# Altium project mb1191.PrjPCB (part 3 of 3)
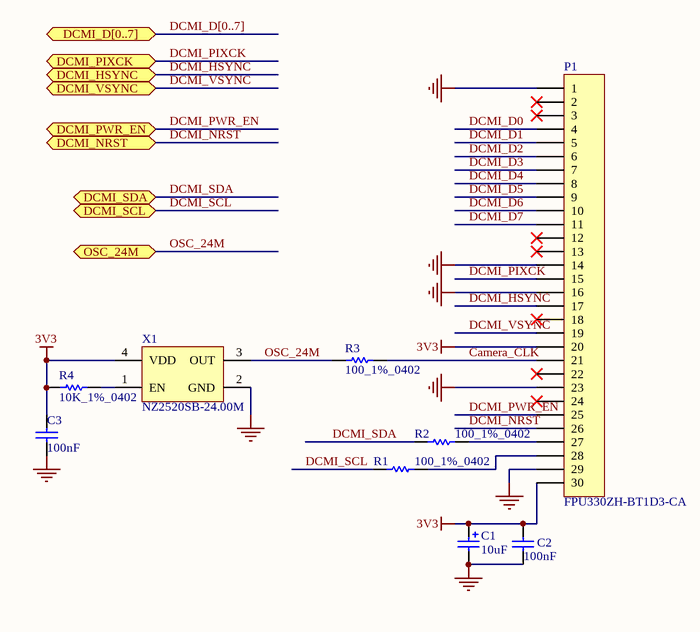
[diagram p13: Camera-Connectors.SchDoc]

## Nets that join several sheets
1V8: ST_LINK_V2-1 (C108.2 U13.2 U13.4), AUDIO (6 pins), USB_OTG_HS (C110.2 U15.28 U15.30)
3V3: ST_LINK_V2-1 (C68.2 C75.2 U7.4 U13.3), AUDIO (14 pins), USB_OTG_FS (R116.2 R126.2 R136.2 R137.2), Peripherals (9 pins), QSPI (C38.2 R57.2 U3.8), LCD-43 (5 pins), Arduino_ Connectors (CN6.2 CN6.4), SDRAM (28 pins), USB_OTG_HS (8 pins), STM32F7 (11 pins), Ethernet (17 pins), Camera-Connectors (7 pins)
5V: ST_LINK_V2-1 (10 pins), USB_OTG_FS (U16.5), Peripherals (SB2.2), Arduino_ Connectors (CN6.5), USB_OTG_HS (C117.1 U15.21 U17.5)
5V_USB_FS: ST_LINK_V2-1 (D3.1 JP1.5), USB_OTG_FS (SB18.1)
5V_USB_HS: ST_LINK_V2-1 (D4.1 JP1.7), USB_OTG_HS (CN12.1 D7.A1 L6.2)
GND: ST_LINK_V2-1 (46 pins), AUDIO (43 pins), USB_OTG_FS (7 pins), Peripherals (8 pins), QSPI (C38.1 U3.4), LCD-43 (8 pins), Arduino_ Connectors (5 pins), SDRAM (46 pins), USB_OTG_HS (23 pins), STM32F7 (54 pins), Ethernet (19 pins), Camera-Connectors (9 pins)
VDD: Peripherals (B1.1 B1.4), STM32F7 (43 pins)
VIN: ST_LINK_V2-1 (C29.2 U6.3), Arduino_ Connectors (CN6.8)
VREF+: Arduino_ Connectors (C90.2 R96.2), STM32F7 (C17.1 C24.2 R28.2 U5.P1)
ARD_A0: Arduino_ Connectors (CN5.1), STM32F7 (U5.N3)
ARD_A1: Arduino_ Connectors (CN5.2), STM32F7 (U5.L1)
ARD_A2: Arduino_ Connectors (CN5.3), STM32F7 (U5.L2)
ARD_A3: Arduino_ Connectors (CN5.4), STM32F7 (U5.L3)
ARD_A4: Arduino_ Connectors (SB5.1), STM32F7 (U5.K1)
ARD_A5: Arduino_ Connectors (SB3.1), STM32F7 (U5.K2)
ARD_D0: Arduino_ Connectors (CN4.1), STM32F7 (U5.G15)
ARD_D1: Arduino_ Connectors (CN4.2), STM32F7 (U5.H15)
ARD_D2: Arduino_ Connectors (CN4.3), STM32F7 (U5.J15)
ARD_D3: Arduino_ Connectors (CN4.4), STM32F7 (U5.A9)
ARD_D4: Arduino_ Connectors (CN4.5), STM32F7 (U5.J14)
ARD_D5: Arduino_ Connectors (CN4.6), STM32F7 (U5.E14)
ARD_D6: Arduino_ Connectors (CN4.7), STM32F7 (U5.P13)
ARD_D7: Arduino_ Connectors (CN4.8), STM32F7 (U5.C13)
ARD_D8: Arduino_ Connectors (CN7.1), STM32F7 (U5.C14)
ARD_D9: Arduino_ Connectors (CN7.2), STM32F7 (U5.A13)
ARD_D10: Arduino_ Connectors (CN7.3), STM32F7 (U5.F15)
ARD_D11: Arduino_ Connectors (CN7.4), STM32F7 (U5.R15)
ARD_D12: Arduino_ Connectors (CN7.5), STM32F7 (U5.R14)
ARD_D13: Arduino_ Connectors (CN7.6 SB8.2), STM32F7 (U5.D14)
ARD_D14: Peripherals (CN2.1), Arduino_ Connectors (CN7.9 SB4.1), STM32F7 (R46.1 U5.B4), Camera-Connectors (R2.1)
ARD_D15: Peripherals (CN2.3), Arduino_ Connectors (CN7.10 SB1.1), STM32F7 (R54.1 U5.A7), Camera-Connectors (R1.1)
Audio_INT: AUDIO (U11.G3), STM32F7 (U5.B11)
AUDIO_SCL: AUDIO (R76.1), LCD-43 (U19.39), STM32F7 (R62.1 U5.N13)
AUDIO_SDA: AUDIO (R83.1), LCD-43 (U19.40), STM32F7 (R61.1 U5.P14)
B_USER: Peripherals (SB6.1), STM32F7 (U5.F3)
DCMI_D0: STM32F7 (U5.N14), Camera-Connectors (P1.4)
DCMI_D1: STM32F7 (U5.P15), Camera-Connectors (P1.5)
DCMI_D2: STM32F7 (U5.N15), Camera-Connectors (P1.6)
DCMI_D3: STM32F7 (U5.M15), Camera-Connectors (P1.7)
DCMI_D4: STM32F7 (U5.E13), Camera-Connectors (P1.8)
DCMI_D5: STM32F7 (U5.C11), Camera-Connectors (P1.9)
DCMI_D6: STM32F7 (U5.B1), Camera-Connectors (P1.10)
DCMI_D7: STM32F7 (U5.B2), Camera-Connectors (P1.11)
DCMI_HSYNC: STM32F7 (U5.N4), Camera-Connectors (P1.17)
DCMI_NRST: ST_LINK_V2-1 (SB15.2), Peripherals (SB7.1), LCD-43 (U19.37), Arduino_ Connectors (CN6.3), USB_OTG_HS (U15.27), STM32F7 (R34.1 U5.J1), Ethernet (U9.15), Camera-Connectors (P1.26)
DCMI_PIXCK: STM32F7 (U5.P3), Camera-Connectors (P1.15)
DCMI_PWR_EN: STM32F7 (U5.E12), Camera-Connectors (P1.25)
DCMI_VSYNC: STM32F7 (U5.D9), Camera-Connectors (P1.19)
EXT_RST: Peripherals (CN2.4), STM32F7 (U5.M12)
FMC_A0: SDRAM (U4.G8), STM32F7 (U5.D2)
FMC_A1: SDRAM (U4.G9), STM32F7 (U5.E2)
FMC_A2: SDRAM (U4.F7), STM32F7 (U5.G2)
FMC_A3: SDRAM (U4.F3), STM32F7 (U5.H2)
FMC_A4: SDRAM (U4.G1), STM32F7 (U5.J2)
FMC_A5: SDRAM (U4.G2), STM32F7 (U5.K3)
FMC_A6: SDRAM (U4.G3), STM32F7 (U5.M6)
FMC_A7: SDRAM (U4.H1), STM32F7 (U5.N6)
FMC_A8: SDRAM (U4.H2), STM32F7 (U5.P6)
FMC_A9: SDRAM (U4.J3), STM32F7 (U5.M8)
FMC_A10: SDRAM (U4.G7), STM32F7 (U5.N7)
FMC_A11: SDRAM (U4.H9), STM32F7 (U5.M7)
FMC_BA0: SDRAM (U4.J7), STM32F7 (U5.N12)
FMC_BA1: SDRAM (U4.H8), STM32F7 (U5.N11)
FMC_D0: SDRAM (U4.R8), STM32F7 (U5.L12)
FMC_D1: SDRAM (U4.N7), STM32F7 (U5.K13)
FMC_D2: SDRAM (U4.R9), STM32F7 (U5.B12)
FMC_D3: SDRAM (U4.N8), STM32F7 (U5.C12)
FMC_D4: SDRAM (U4.P9), STM32F7 (U5.R8)
FMC_D5: SDRAM (U4.M8), STM32F7 (U5.N9)
FMC_D6: SDRAM (U4.M7), STM32F7 (U5.P9)
FMC_D7: SDRAM (U4.L8), STM32F7 (U5.R9)
FMC_D8: SDRAM (U4.L2), STM32F7 (U5.P10)
FMC_D9: SDRAM (U4.M3), STM32F7 (U5.R10)
FMC_D10: SDRAM (U4.M2), STM32F7 (U5.R12)
FMC_D11: SDRAM (U4.P1), STM32F7 (U5.P11)
FMC_D12: SDRAM (U4.N2), STM32F7 (U5.R11)
FMC_D13: SDRAM (U4.R1), STM32F7 (U5.L15)
FMC_D14: SDRAM (U4.N3), STM32F7 (U5.L14)
FMC_D15: SDRAM (U4.R2), STM32F7 (U5.K15)
FMC_NBL0: SDRAM (U4.K9), STM32F7 (U5.A6)
FMC_NBL1: SDRAM (U4.K1), STM32F7 (U5.A5)
FMC_SDCKE0: SDRAM (U4.J2), STM32F7 (U5.L4)
FMC_SDCLK: SDRAM (U4.J1), STM32F7 (U5.H14)
FMC_SDNCAS: SDRAM (U4.K7), STM32F7 (U5.B7)
FMC_SDNE0: SDRAM (U4.J8), STM32F7 (U5.J4)
FMC_SDNRAS: SDRAM (U4.J9), STM32F7 (U5.P8)
FMC_SDNWE: SDRAM (U4.K8), STM32F7 (U5.J3)
LCD_B0: LCD-43 (U19.21), STM32F7 (U5.A1)
LCD_B1: LCD-43 (U19.22), STM32F7 (U5.B9)
LCD_B2: LCD-43 (U19.23), STM32F7 (U5.C9)
LCD_B3: LCD-43 (U19.24), STM32F7 (U5.D10)
LCD_B4: LCD-43 (U19.25), STM32F7 (U5.C7)
LCD_B5: LCD-43 (U19.26), STM32F7 (U5.D7)
LCD_B6: LCD-43 (U19.27), STM32F7 (U5.C6)
LCD_B7: LCD-43 (U19.28), STM32F7 (U5.C5)
LCD_BL_CTRL: LCD-43 (R81.2), STM32F7 (U5.D8)
LCD_CLK: LCD-43 (U19.30), STM32F7 (U5.H3)
LCD_DE: LCD-43 (U19.34), STM32F7 (U5.C4)
LCD_DISP: LCD-43 (R74.1 U19.31), STM32F7 (U5.E3)
LCD_G0: LCD-43 (U19.13), STM32F7 (U5.J12)
LCD_G1: LCD-43 (U19.14), STM32F7 (U5.H12)
LCD_G2: LCD-43 (U19.15), STM32F7 (U5.J13)
LCD_G3: LCD-43 (U19.16), STM32F7 (U5.H13)
LCD_G4: LCD-43 (U19.17), STM32F7 (U5.G12)
LCD_G5: LCD-43 (U19.18), STM32F7 (U5.G13)
LCD_G6: LCD-43 (U19.19), STM32F7 (U5.F12)
LCD_G7: LCD-43 (U19.20), STM32F7 (U5.F13)
LCD_HSYNC: LCD-43 (U19.32), STM32F7 (U5.D5)
LCD_INT: LCD-43 (U19.38), STM32F7 (U5.G3)
LCD_R0: LCD-43 (U19.5), STM32F7 (U5.G4)
LCD_R1: LCD-43 (U19.6), STM32F7 (U5.R6)
LCD_R2: LCD-43 (U19.7), STM32F7 (U5.R7)
LCD_R3: LCD-43 (U19.8), STM32F7 (U5.P7)
LCD_R4: LCD-43 (U19.9), STM32F7 (U5.N8)
LCD_R5: LCD-43 (U19.10), STM32F7 (U5.M9)
LCD_R6: LCD-43 (U19.11), STM32F7 (U5.M14)
LCD_R7: LCD-43 (U19.12), STM32F7 (U5.K12)
LCD_VSYNC: LCD-43 (U19.33), STM32F7 (U5.E4)
OSC_24M: USB_OTG_HS (R114.1), Camera-Connectors (R3.1 X1.3)
OSC_25M: STM32F7 (R30.1 X2.3), Ethernet (R78.1)
OTG_FS_ID: USB_OTG_FS (R133.1), STM32F7 (U5.D15)
OTG_FS_N: USB_OTG_FS (R132.1 U18.D3), STM32F7 (U5.C15)
OTG_FS_OverCurrent: USB_OTG_FS (R119.2), STM32F7 (U5.D11)
OTG_FS_P: USB_OTG_FS (R125.1 U18.C3), STM32F7 (U5.B15)
OTG_FS_PowerSwitchOn: USB_OTG_FS (R117.1), STM32F7 (U5.C10)
OTG_FS_VBUS: USB_OTG_FS (6 pins), STM32F7 (R58.2 R63.1)
OTG_HS_OverCurrent: USB_OTG_HS (R130.2), STM32F7 (U5.A2)
PA1: STM32F7 (U5.N2), Ethernet (R77.1 U9.14)
PA2: STM32F7 (U5.P2), Ethernet (R65.1 U9.12)
PA3: USB_OTG_HS (U15.3), STM32F7 (U5.R2)
PA5: USB_OTG_HS (U15.1), STM32F7 (U5.P4)
PA7: STM32F7 (U5.R3), Ethernet (R66.2)
PA13: ST_LINK_V2-1 (SB17.2), STM32F7 (U5.A15)
PA14: ST_LINK_V2-1 (SB14.2), STM32F7 (U5.A14)
PB0: USB_OTG_HS (U15.4), STM32F7 (U5.R5)
PB1: USB_OTG_HS (U15.5), STM32F7 (U5.R4)
PB2: QSPI (U3.6), STM32F7 (R44.1)
PB3: ST_LINK_V2-1 (SB16.2), STM32F7 (U5.A10)
PB5: USB_OTG_HS (U15.13), STM32F7 (U5.A8)
PB6: QSPI (R57.1 U3.1), STM32F7 (U5.B6)
PB7: ST_LINK_V2-1 (SB12.1), STM32F7 (U5.B5)
PB10: USB_OTG_HS (U15.6), STM32F7 (U5.P12)
PB11: USB_OTG_HS (U15.7), STM32F7 (U5.R13)
PB12: USB_OTG_HS (U15.9), STM32F7 (U5.L13)
PB13: USB_OTG_HS (U15.10), STM32F7 (U5.K14)
PC0: USB_OTG_HS (U15.29), STM32F7 (U5.M2)
PC1: STM32F7 (U5.M3), Ethernet (U9.13)
PC2: USB_OTG_HS (U15.31), STM32F7 (U5.M4)
PC4: STM32F7 (U5.N5), Ethernet (R69.2)
PC5: STM32F7 (U5.P5), Ethernet (R71.2)
PC8: Peripherals (CN3.7 R14.1), STM32F7 (U5.G14)
PC9: Peripherals (CN3.8 R13.1), STM32F7 (U5.F14)
PC10: Peripherals (CN3.1 R17.1), STM32F7 (U5.B14)
PC11: Peripherals (CN3.2 R16.1), STM32F7 (U5.B13)
PC12: Peripherals (CN3.5), STM32F7 (U5.A12)
PC13: Peripherals (R11.1 R12.1), STM32F7 (U5.D1)
PD2: Peripherals (CN3.3 R15.1), STM32F7 (U5.D12)
PD7: AUDIO (R8.2 R22.2 U2.4), STM32F7 (U5.A11)
PD11: QSPI (U3.5), STM32F7 (U5.N10)
PD12: QSPI (U3.2), STM32F7 (U5.M10)
PD13: QSPI (U3.7), STM32F7 (U5.M11)
PE2: QSPI (U3.3), STM32F7 (U5.A3)
PG2: STM32F7 (U5.M13), Ethernet (R68.2 U9.10)
PG10: AUDIO (U11.F2), STM32F7 (U5.C8)
PG11: STM32F7 (U5.B8), Ethernet (U9.16)
PG13: STM32F7 (U5.B3), Ethernet (U9.17)
PG14: STM32F7 (U5.A4), Ethernet (U9.18)
PH4: USB_OTG_HS (U15.2), STM32F7 (U5.H4)
PH15: AUDIO (TP3.1), STM32F7 (U5.D13)
PI4: AUDIO (U11.D3), STM32F7 (U5.C3)
PI5: AUDIO (U11.G1), STM32F7 (U5.D3)
PI6: AUDIO (U11.E4), STM32F7 (U5.D6)
PI7: AUDIO (U11.E3), STM32F7 (U5.D4)
VCP_TX: ST_LINK_V2-1 (SB13.1), STM32F7 (R64.1)